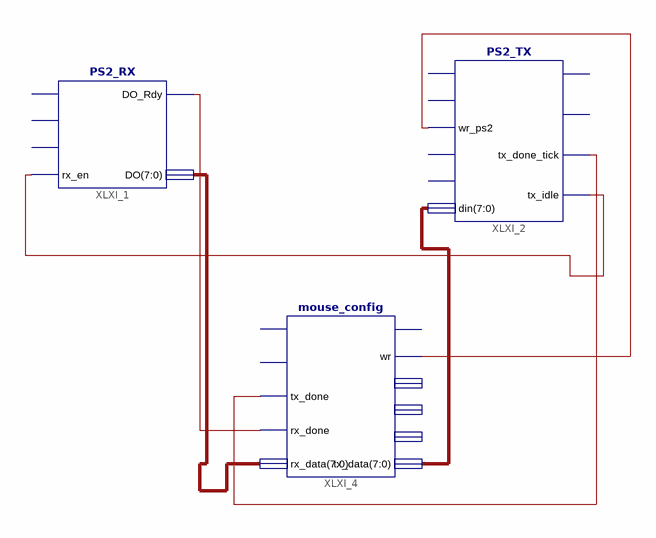
[diagram p0: schematic sheet 1]
// Xilinx ISE schematic test_mouse.sch (spartan3a) as structural Verilog: 3 symbols, 0 ports
module test_mouse (
);

  wire XLXN_4, XLXN_5, XLXN_7, XLXN_18;
  wire [7:0] XLXN_11, XLXN_16;

  PS2_RX XLXI_1 (.rx_en(XLXN_18), .DO_Rdy(XLXN_7), .DO(XLXN_16));  // open: Clk_50MHz, PS2_Clk, PS2_Data
  PS2_TX XLXI_2 (
    .wr_ps2(XLXN_4), .din(XLXN_11), .tx_done_tick(XLXN_5), .tx_idle(XLXN_18));  // open: clk, reset, ps2c_in, ps2d_in, ps2c_out, ps2d_out
  mouse_config XLXI_4 (
    .tx_done(XLXN_5), .rx_done(XLXN_7), .rx_data(XLXN_16), .wr(XLXN_4), .tx_data(XLXN_11));  // open: clk, reset, m_done_tick, x, y, btn
endmodule
